# EAGLE design Myosense.v1 (EAGLE 9.5.1)
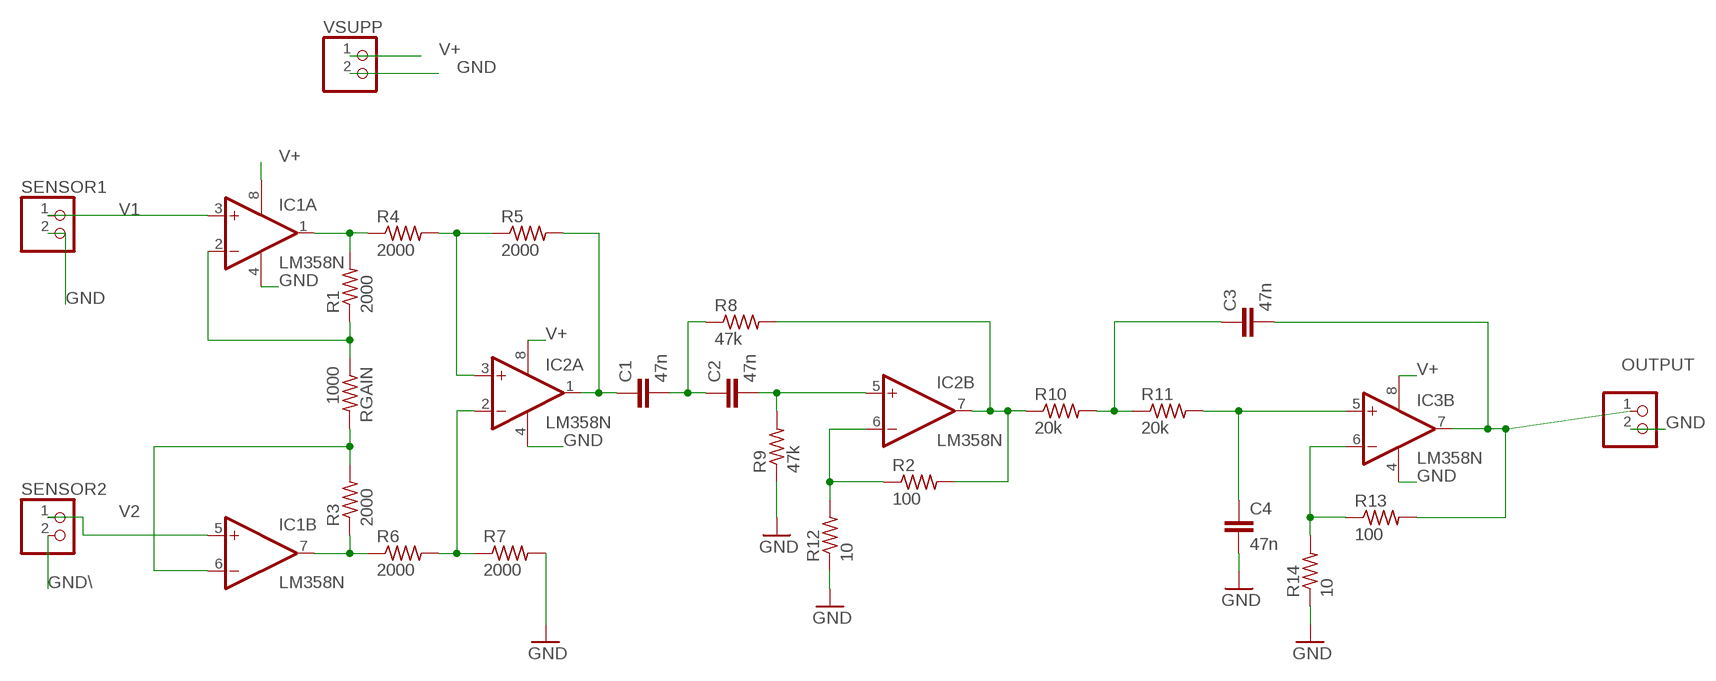
[diagram p0: schematic, sheet 1]

## Parts
C1  47n  C2,5-3  [C2.5-3]
C2  47n  C2,5-3  [C2.5-3]
C3  47n  C2,5-3  [C2.5-3]
C4  47n  C2,5-3  [C2.5-3]
IC1  LM358N  [DIL08]
IC2  LM358N  [DIL08]
IC3  LM358N  [DIL08]
OUTPUT  PINHD-1X2  [1X02]
R1  2000  R-US_0204/5  [0204/5]
R2  100  R-US_0204/5  [0204/5]
R3  2000  R-US_0204/5  [0204/5]
R4  2000  R-US_0204/5  [0204/5]
R5  2000  R-US_0204/5  [0204/5]
R6  2000  R-US_0204/5  [0204/5]
R7  2000  R-US_0204/5  [0204/5]
R8  47k  R-US_0204/5  [0204/5]
R9  47k  R-US_0204/5  [0204/5]
R10  20k  R-US_0204/5  [0204/5]
R11  20k  R-US_0204/5  [0204/5]
R12  10  R-US_0204/5  [0204/5]
R13  100  R-US_0204/5  [0204/5]
R14  10  R-US_0204/5  [0204/5]
RGAIN  1000  R-US_0204/5  [0204/5]
SENSOR1  PINHD-1X2  [1X02]
SENSOR2  PINHD-1X2  [1X02]
VSUPP  PINHD-1X2  [1X02]

## Nets
GND: C4.2 IC1.4(P:V-) IC2.4(P:V-) IC3.4(P:V-) OUTPUT.2 R7.2 R9.1 R12.1 R14.1 SENSOR1.2 VSUPP.2
GND\: SENSOR2.2
N$1: IC1.1(A:OUT) R1.2 R4.1
N$2: IC1.2(A:-IN) R1.1 RGAIN.1
N$3: IC1.6(B:-IN) R3.2 RGAIN.2
N$4: IC2.3(A:+IN) R4.2 R5.1
N$5: IC1.7(B:OUT) R3.1 R6.1
N$6: IC2.2(A:-IN) R6.2 R7.1
N$7: C1.1 IC2.1(A:OUT) R5.2
N$10: C1.2 C2.1 R8.1
N$11: C2.2 IC2.5(B:+IN) R9.2
N$12: IC2.7(B:OUT) R2.2 R8.2 R10.1
N$13: IC2.6(B:-IN) R2.1 R12.2
N$14: C3.1 R10.2 R11.1
N$15: C4.1 IC3.5(B:+IN) R11.2
N$16: IC3.6(B:-IN) R13.1 R14.2
N$17: C3.2 IC3.7(B:OUT) OUTPUT.1 R13.2
V1: IC1.3(A:+IN) SENSOR1.1
V2: IC1.5(B:+IN) SENSOR2.1
V+: IC1.8(P:V+) IC2.8(P:V+) IC3.8(P:V+) VSUPP.1
Unconnected: IC3.1(A:OUT) IC3.2(A:-IN) IC3.3(A:+IN)

## Library data of the parts
C1-C4 = capacitor-wima:C: CAPACITOR naming: grid - package width
IC1-IC3 = 3DPC:LM358: OP AMP also LM158; LM258; LM2904 Source: http://cache.national.com/ds/LM/LM158.pdf
OUTPUT VSUPP = 3DPC:PINHD-1X2: PIN HEADER
R1-R14 RGAIN = rcl:R-US_: RESISTOR, American symbol; SPICEPREFIX: R
SENSOR1 SENSOR2 = pinhead:PINHD-1X2: PIN HEADER

## Board
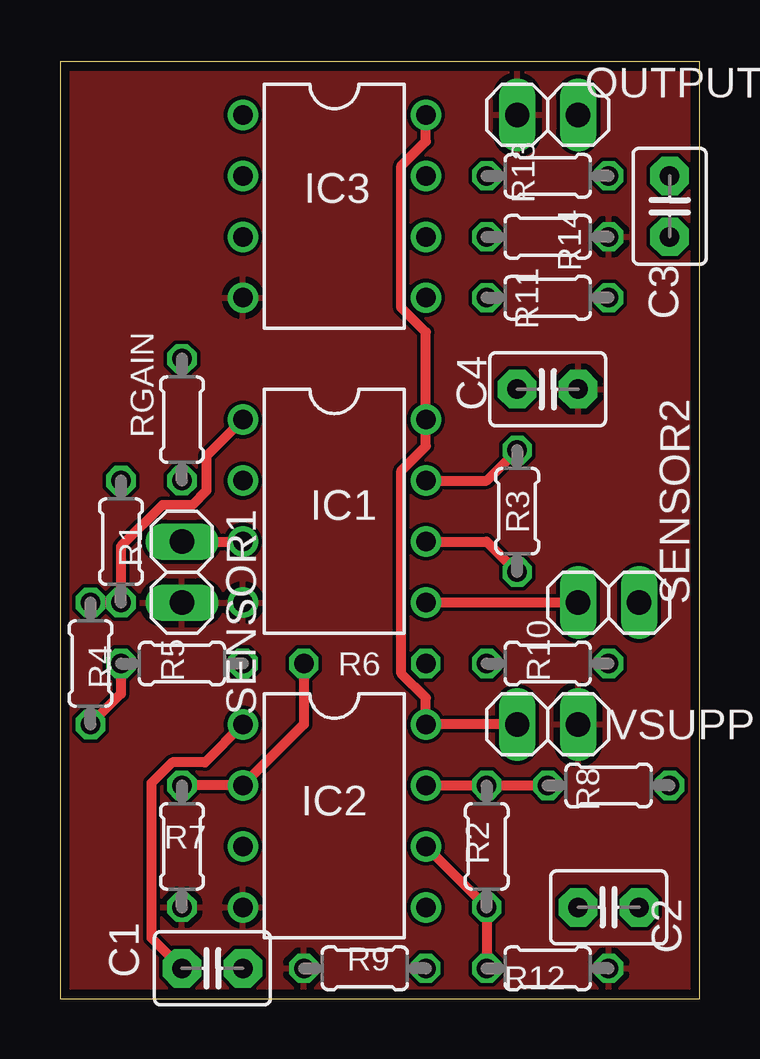
[diagram p1: board, top side]
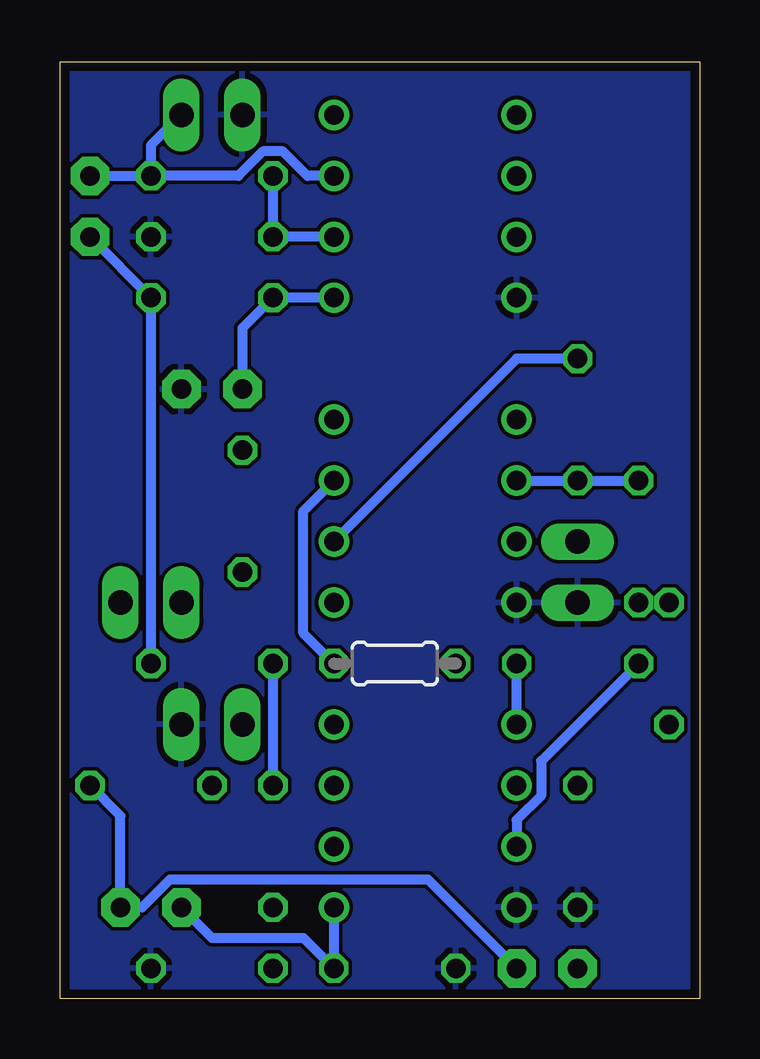
[diagram p2: board, bottom side, seen from below]

Size 26.65 x 39.04 mm. Coordinates in mm from the lower left corner, seen from the top.
Outline: 0,0 26.65,0 26.65,39.04 0,39.04 0,0
Copper layers (1*16): Top 0.035559375mm / dielectric 1.6mm / Bottom 0.035559375mm
Design rules "oshpark-2layer": minimum track width 6mil, minimum drill 10mil, track to track 6mil, track to pad 6mil, pad to pad 6mil, via to via 6mil, smd to smd 6mil, copper to edge 15mil, drill to drill 6mil, minimum pad ring 5mil, minimum via ring 5mil, stop-mask expansion 2.5mil, vias tented up to drill 0mil, thermal gap 10mil

### Footprints (pad centres in the part's own frame; a part is rotated, then mirrored left to right if it is on the bottom)
C2.5-3 = drill 0.813 pad 1.6 octagon: 1 -1.27,0; 2 1.27,0
DIL08 = drill 0.813 pad 1.27: 1 -3.81,-3.81; 2 -1.27,-3.81; 3 1.27,-3.81; 4 3.81,-3.81; 5 3.81,3.81; 6 1.27,3.81; 7 -1.27,3.81; 8 -3.81,3.81
1X02 = drill 1.016 long: 1 -1.27,0; 2 1.27,0
0204/5 = drill 0.813 octagon: 1 -2.54,0; 2 2.54,0

### Placement (x,y rotation side)
C1  6.35,1.27 0 top
C2  22.86,3.81 180 top
C3  25.4,33.02 90 top
C4  20.32,25.4 0 top
IC1  11.43,20.32 270 top
IC2  11.43,7.62 270 top
IC3  11.43,33.02 270 top
OUTPUT  20.32,36.83 180 top
R1  2.54,19.05 270 top
R2  17.78,6.35 90 top
R3  19.05,20.32 270 top
R4  1.27,13.97 270 top
R5  5.08,13.97 0 top
R6  12.7,13.97 0 bottom
R7  5.08,6.35 270 top
R8  22.86,8.89 180 top
R9  12.7,1.27 0 top
R10  20.32,13.97 0 top
R11  20.32,29.21 180 top
R12  20.32,1.27 180 top
R13  20.32,34.29 0 top
R14  20.32,31.75 180 top
RGAIN  5.08,24.13 90 top
SENSOR1  5.08,17.78 270 top
SENSOR2  22.86,16.51 0 top
VSUPP  20.32,11.43 0 top

### Tracks (layer width: path | path; a pad name or v marks a point on that pad's centre or on a via)
GND
  pour Top: -7.62,50.8 35.56,50.8 35.56,-8.89 -8.89,-8.89 -8.89,50.8
  pour Bottom: -8.89,50.8 35.56,50.8 35.56,-11.43 -8.89,-11.43
N$1
  Top 0.406: IC1.1 6.1,22.61 6.1,21.17 5.5,20.57 4.26,20.57 2.54,18.85 R1.2 R4.1
N$2
  Bottom 0.406: IC1.2 RGAIN.1 R1.1
N$3
  Top 0.406: IC1.6 17.78,19.05 R3.2
  Bottom 0.406: RGAIN.2 7.62,26.67 IC1.6
N$4
  Top 0.406: R5.1 2.54,12.7 R4.2
  Bottom 0.406: R5.1 6.6,9.91 6.6,8.47 7.62,7.45 IC2.3
N$5
  Top 0.406: IC1.7 17.78,21.59 R3.1
  Bottom 0.406: R6.1 16.51,15.24 16.51,20.32 IC1.7
N$6
  Top 0.406: R6.2 10.16,11.43 IC2.2 R7.1
N$7
  Top 0.406: IC2.1 6.04,9.86 4.68,9.86 3.81,8.98 3.81,2.54 C1.1
  Bottom 0.406: IC2.1 R5.2
N$10
  Bottom 0.406: R8.1 24.13,7.62 C2.1 23.22,3.81 22.07,4.97 11.32,4.97 C1.2
N$11
  Bottom 0.406: IC2.5 R9.2 16.51,2.54 20.32,2.54 C2.2
N$12
  Top 0.406: IC2.7 R2.2 R8.2
  Bottom 0.406: R10.1 R2.2
N$13
  Top 0.406: IC2.6 R2.1 R12.2
N$14
  Bottom 0.406: C3.1 R11.1 R10.2
N$15
  Bottom 0.406: IC3.5 R11.2 19.05,27.94 C4.1
N$16
  Bottom 0.406: IC3.6 R14.2 R13.1
N$17
  Bottom 0.406: IC3.7 16.34,34.29 17.36,35.31 18.2,35.31 19.22,34.29 R13.2 | OUTPUT.1 22.86,35.56 R13.2 | C3.2 R13.2
V1
  Top 0.406: SENSOR1.1 IC1.3
V2
  Top 0.406: SENSOR2.1 IC1.5
V+
  Top 0.406: VSUPP.1 IC2.8 15.24,12.53 14.22,13.55 14.22,22.01 15.24,23.03 IC1.8 15.24,27.77 14.22,28.79 14.22,34.71 15.24,35.73 IC3.8